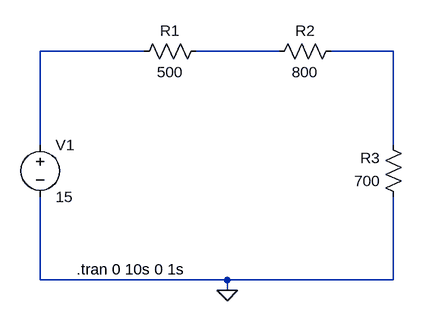
[diagram p0: schematic Kichrof Voltage.asc]
Kichrof Voltage.asc, the LTspice schematic file:
Version 4
SHEET 1 880 680
WIRE 192 48 32 48
WIRE 400 48 272 48
WIRE 576 48 480 48
WIRE 32 192 32 48
WIRE 576 192 576 48
WIRE 32 400 32 272
WIRE 320 400 32 400
WIRE 576 400 576 272
WIRE 576 400 320 400
WIRE 320 416 320 400
FLAG 320 416 0
SYMBOL res 288 32 R90
WINDOW 0 0 56 VBottom 2
WINDOW 3 32 56 VTop 2
SYMATTR InstName R1
SYMATTR Value 500
SYMBOL res 496 32 R90
WINDOW 0 0 56 VBottom 2
WINDOW 3 32 56 VTop 2
SYMATTR InstName R2
SYMATTR Value 800
SYMBOL res 592 288 R180
WINDOW 0 36 76 Left 2
WINDOW 3 36 40 Left 2
SYMATTR InstName R3
SYMATTR Value 700
SYMBOL voltage 32 176 R0
SYMATTR InstName V1
SYMATTR Value 15
TEXT 88 384 Left 2 !.tran 0 10s 0 1s

The netlist it stands for:
* Kichrof Voltage.asc
R1 N002 N001 500
R2 N003 N002 800
R3 0 N003 700
V1 N001 0 15
.tran 0 10s 0 1s
.backanno
.end